# EasyEDA Pro project ProPrj_Embedded Tools OSJTAG Adapter_2024-11-13.epro

# Board PCB1
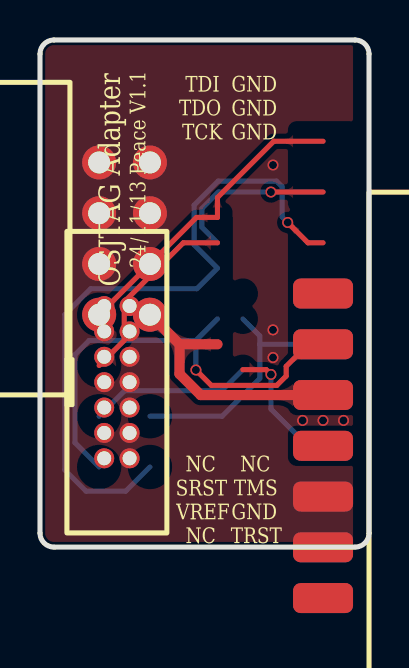
[diagram p0: board, top side]
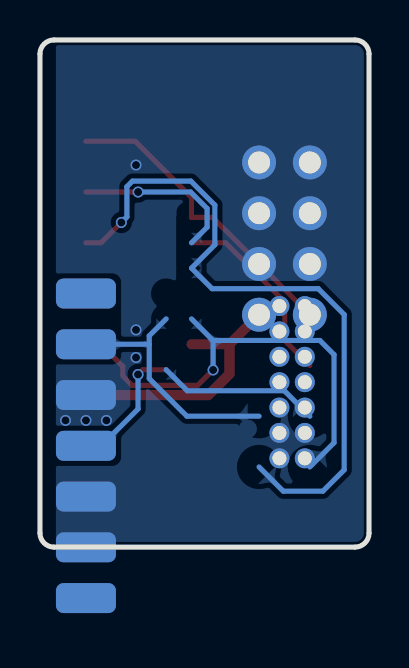
[diagram p1: board, bottom side, seen from below]

Outline 16.46 x 25.38 mm; copper layers: Top Layer, Bottom Layer. Coordinates in mm from the lower left corner of the outline.
Outline path: 0,24.68 0,0.7 arc(0.21,0.21) 0.7,0 15.76,0 arc(16.25,0.21) 16.46,0.7 16.46,24.68 arc(16.25,25.17) 15.76,25.38 0.7,25.38 arc(0.21,25.17) 0,24.68
Stack: Top Layer 0.035mm / Dielectric1 1.51mm FR4 er 4.5 / Bottom Layer 0.035mm

## Design rules (mm)
template: 双面板
spacing copperThickness1oz (default): track to track 0.102, other pairs 0.102 to 0.201
spacing copperThickness2oz: track to track 0.203, other pairs 0.152 to 0.3
track width copperThickness1oz (default): min 0.102, default 0.254, max 2.54
track width copperThickness2oz: min 0.203, default 0.254, max 2.54
differential pair differentialPair (default): width min 0.127, default 0.254, max 2.54; gap min 0.152, default 0.152
via viaSize (default): diameter min 0.399, default 0.399, max 10; hole min 0.3, default 0.3, max 6.299

## Placement (name value [footprint] x y rotation side)
P2  d52c2169927f42f8bc50173642977931  [HDR-TH_8P-P2.54-V-M-R2-C4-S2.54_IDC]  4.23 7.82 270 top
P3  -  [IDC-SMD_14P-P2.54]  14.16 12.69 0 top
P?  f60532324463458db1be2ff4bf136cf2  [IDC-TH_14P-P1.27-H-F-R2-C7-W7.7_1]  7.01 12.69 0 top

## Footprints (pads in the part's own frame, mm; a bottom-side part is the same pattern mirrored in y, then rotated)
HDR-TH_8P-P2.54-V-M-R2-C4-S2.54_IDC
  rrect 1.7x1.7 hole 1.1: 1(-11.43,1.27)
  round 1.7 hole 1.1: 2(-11.43,-1.27) 3(-8.89,1.27) 4(-8.89,-1.27) 5(-6.35,1.27) 6(-6.35,-1.27) 7(-3.81,1.27) 8(-3.81,-1.27)
IDC-SMD_14P-P2.54
  rrect 3x1.5 smd: 1(0,0) 3(0,-2.54) 5(0,-5.08) 7(0,-7.62) 9(0,-10.16) 11(0,-12.7) 13(0,-15.24)
  rrect 3x1.5 smd far side: 2(0,0) 4(0,-2.54) 6(0,-5.08) 8(0,-7.62) 10(0,-10.16) 12(0,-12.7) 14(0,-15.24)
IDC-TH_14P-P1.27-H-F-R2-C7-W7.7_1
  rrect 1x1 hole 0.7: 1(-3.801,-0.626)
  round 1 hole 0.7: 2(-2.531,-0.626) 3(-3.801,-1.896) 4(-2.531,-1.896) 5(-3.801,-3.166) 6(-2.531,-3.166) 7(-3.801,-4.436) 8(-2.531,-4.436) 9(-3.801,-5.706) 10(-2.531,-5.706) 11(-3.801,-6.976) 12(-2.531,-6.976) 13(-3.801,-8.246) 14(-2.531,-8.246)

## Nets
GND: P2.3 P3.2 P3.4 P3.6 P3.12 P?.2 P?.4 P?.6 P?.12
SRST: P2.8 P3.9 P?.9
TCK: P2.7 P3.5 P?.5
TDI: P2.2 P3.1 P?.1
TDO: P2.4 P3.3 P?.3
TMS: P2.5 P3.10 P?.10
TRST: P2.6 P3.14 P?.14
VREF: P2.1 P3.11 P?.11

Pads without a net: P3 7 8 13; P? 7 8 13

## Via types
v1: diameter 0.55, hole 0.4, Top Layer to Bottom Layer, 10 vias

## Routing (per net, layer and track width the routed paths; a pad name or vN(x,y) marks a point on that pad's centre or on a via; arc(x,y) is an arc through that point)
GND:
  vias: v1(11.66,19.12) v1(11.66,10.87) v1(11.66,9.49) v1(13.14,6.34) v1(14.16,6.34) v1(15.18,6.34)
SRST: length 23.3
  Top Layer w0.254: v1(7.8,8.86) 8.57,8.09 11.84,8.09 12.32,8.56 12.32,9.05 13.42,10.15 14.16,10.15
  Bottom Layer w0.254: 2.96,4.01 1.75,5.22 1.75,9.63 2.46,10.34 7.8,10.34 ; 7.8,10.34 8.88,11.42 ; 7.8,10.34 v1(7.8,8.86)
TCK: length 34.3
  Top Layer w0.254: 14.16,15.23 13.41,15.23 v1(12.39,16.25)
  Bottom Layer w0.254: 5.5,4.01 4.29,2.8 2.31,2.8 1.24,3.86 1.24,11.64 2.54,12.93 7.85,12.93 8.88,13.96 7.71,15.13 7.71,17.12 8.91,18.32 11.83,18.32 12.11,18.04 12.11,16.52 v1(12.39,16.25)
TDI: length 15.4
  Top Layer w0.254: 2.96,11.63 7.83,16.5 8.88,16.5 8.88,17.49 11.69,20.31 14.16,20.31
TDO: length 18
  Top Layer w0.254: 14.16,17.77 v1(11.55,17.77) ; 2.96,9.09 4.21,10.34 4.21,12.27 7.17,15.23 8.88,15.23
  Bottom Layer w0.254: v1(11.55,17.77) 8.92,17.77 8.1,16.94 8.1,16.01 8.88,15.23
TMS: length 12.8
  Bottom Layer w0.254: 11,10.15 11,8.44 9.11,6.55 5.5,6.55 ; 11,10.15 14.16,10.15 ; 11,10.15 11,10.57 10.15,11.42
TRST: length 14.8
  Top Layer w0.254: 10.15,8.88 11.31,8.88 v1(11.55,8.64)
  Bottom Layer w0.254: 14.16,5.07 13.4,5.07 11.55,6.91 v1(11.55,8.64) ; 10.15,8.88 9.09,7.83 4.24,7.83 2.96,6.55
VREF: length 13.1
  Top Layer w0.508: 6.98,10.15 6.98,8.67 8.04,7.61 14.16,7.61 ; 6.98,10.15 8.88,10.15 ; 6.98,10.15 5.5,11.63

## Copper pours and planes (outline as drawn; the poured copper is in the pictures)
GND on Top Layer: 0,25.38 15.66,25.38 15.66,0 0,0
GND on Bottom Layer: 0,25.38 15.66,25.38 15.66,0 0,0

Small or netless copper shapes (teardrops, artwork), in the pictures only: 18 on Top Layer, 18 on Bottom Layer

## Text on the board
Top Silkscreen Layer: SRST | VREF | TDO | TCK | TDI | NC | TRST | GND | TMS | 24/11/13 Peace V1.1 | OSJTAG Adapter
